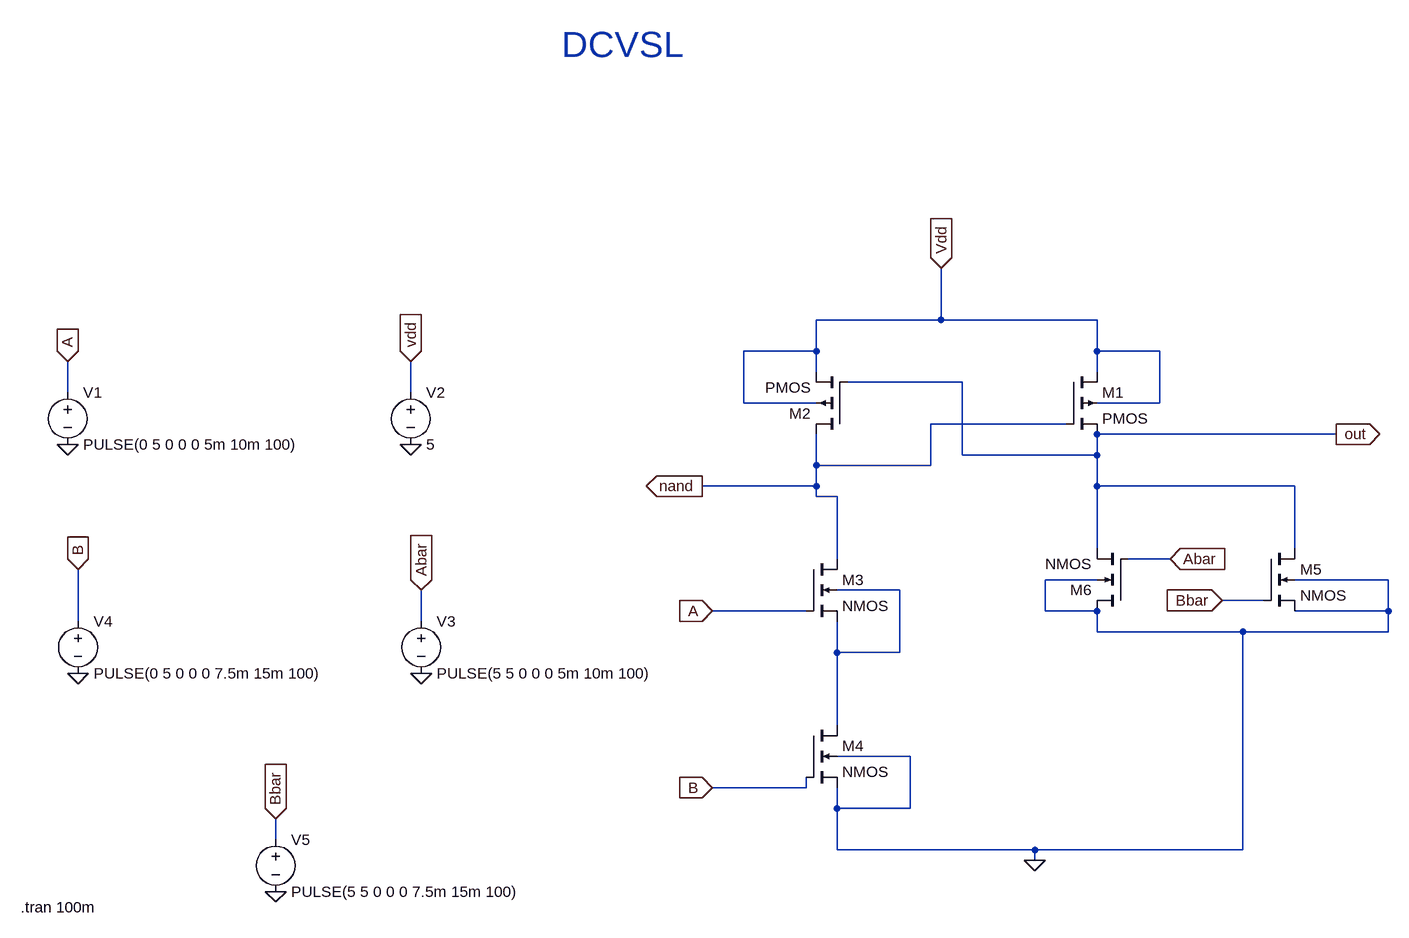
[diagram p0: schematic DCVSL.asc]
DCVSL.asc, the LTspice schematic file:
Version 4
SHEET 1 916 872
WIRE 192 -48 192 -128
WIRE 192 -48 0 -48
WIRE 432 -48 192 -48
WIRE 0 0 0 -48
WIRE 0 0 -112 0
WIRE 432 0 432 -48
WIRE 528 0 432 0
WIRE 0 32 0 0
WIRE 432 32 432 0
WIRE 224 48 48 48
WIRE -1152 64 -1152 16
WIRE -624 64 -624 16
WIRE -112 80 -112 0
WIRE 0 80 -112 80
WIRE 528 80 528 0
WIRE 528 80 432 80
WIRE 384 112 176 112
WIRE 800 128 432 128
WIRE 224 160 224 48
WIRE 432 160 432 128
WIRE 432 160 224 160
WIRE 0 176 0 128
WIRE 176 176 176 112
WIRE 176 176 0 176
WIRE 0 208 0 176
WIRE 0 208 -176 208
WIRE 432 208 432 160
WIRE 736 208 432 208
WIRE 0 224 0 208
WIRE 32 224 0 224
WIRE 432 304 432 208
WIRE 736 304 736 208
WIRE 32 320 32 224
WIRE 544 320 480 320
WIRE 432 352 352 352
WIRE 880 352 736 352
WIRE 128 368 32 368
WIRE 688 384 624 384
WIRE -16 400 -160 400
WIRE 352 400 352 352
WIRE 432 400 352 400
WIRE 880 400 880 352
WIRE 880 400 736 400
WIRE -1136 416 -1136 336
WIRE -608 416 -608 368
WIRE 432 432 432 400
WIRE 656 432 432 432
WIRE 880 432 880 400
WIRE 880 432 656 432
WIRE 32 464 32 416
WIRE 128 464 128 368
WIRE 128 464 32 464
WIRE 32 576 32 464
WIRE 144 624 32 624
WIRE -16 672 -16 656
WIRE -16 672 -160 672
WIRE 32 704 32 672
WIRE 144 704 144 624
WIRE 144 704 32 704
WIRE -832 752 -832 720
WIRE 32 768 32 704
WIRE 336 768 32 768
WIRE 656 768 656 432
WIRE 656 768 336 768
WIRE 336 784 336 768
FLAG -160 400 A
IOPIN -160 400 In
FLAG -160 672 B
IOPIN -160 672 In
FLAG 544 320 Abar
IOPIN 544 320 In
FLAG 624 384 Bbar
IOPIN 624 384 In
FLAG 192 -128 Vdd
IOPIN 192 -128 In
FLAG -176 208 nand
IOPIN -176 208 Out
FLAG 800 128 out
IOPIN 800 128 Out
FLAG -1152 16 A
IOPIN -1152 16 In
FLAG -608 368 Abar
IOPIN -608 368 In
FLAG -1136 336 B
IOPIN -1136 336 In
FLAG -832 720 Bbar
IOPIN -832 720 In
FLAG -624 16 vdd
IOPIN -624 16 In
FLAG -624 144 0
FLAG -1152 144 0
FLAG -1136 496 0
FLAG -608 496 0
FLAG -832 832 0
FLAG 336 784 0
SYMBOL pmos4 384 32 R0
SYMATTR InstName M1
SYMBOL pmos4 48 128 R180
SYMATTR InstName M2
SYMBOL nmos4 -16 320 R0
SYMATTR InstName M3
SYMBOL nmos4 -16 576 R0
SYMATTR InstName M4
SYMBOL nmos4 688 304 R0
SYMATTR InstName M5
SYMBOL nmos4 480 400 R180
SYMATTR InstName M6
SYMBOL voltage -1152 48 R0
WINDOW 123 0 0 Left 0
WINDOW 39 0 0 Left 0
SYMATTR InstName V1
SYMATTR Value PULSE(0 5 0 0 0 5m 10m 100)
SYMBOL voltage -624 48 R0
WINDOW 123 0 0 Left 0
WINDOW 39 0 0 Left 0
SYMATTR InstName V2
SYMATTR Value 5
SYMBOL voltage -608 400 R0
WINDOW 123 0 0 Left 0
WINDOW 39 0 0 Left 0
SYMATTR InstName V3
SYMATTR Value PULSE(5 5 0 0 0 5m 10m 100)
SYMBOL voltage -1136 400 R0
SYMATTR InstName V4
SYMATTR Value PULSE(0 5 0 0 0 7.5m 15m 100)
SYMBOL voltage -832 736 R0
SYMATTR InstName V5
SYMATTR Value PULSE(5 5 0 0 0 7.5m 15m 100)
TEXT -1224 856 Left 2 !.tran 100m
TEXT -392 -472 Left 5 ;DCVSL

The netlist it stands for:
* DCVSL.asc
M1 Vdd nand out Vdd PMOS
M2 nand out Vdd Vdd PMOS
M3 nand A N001 N001 NMOS
M4 N001 B 0 0 NMOS
M5 out Bbar 0 0 NMOS
M6 0 Abar out 0 NMOS
V1 A 0 PULSE(0 5 0 0 0 5m 10m 100)
V2 Vdd 0 5
V3 Abar 0 PULSE(5 5 0 0 0 5m 10m 100)
V4 B 0 PULSE(0 5 0 0 0 7.5m 15m 100)
V5 Bbar 0 PULSE(5 5 0 0 0 7.5m 15m 100)
.model NMOS NMOS
.model PMOS PMOS
.lib standard.mos
.tran 100m
* DCVSL
.backanno
.end